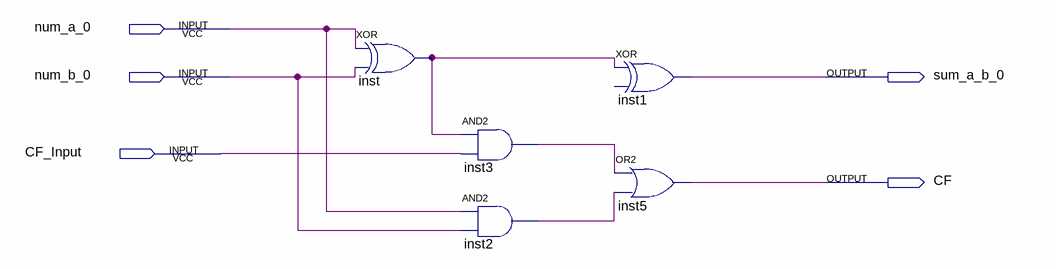
[diagram p0: schematic sheet]
// Quartus schematic alu_scheme.bdf as structural Verilog: 5 symbols, 5 pins
module alu_scheme (
  input  num_a_0,
  input  num_b_0,
  input  CF_Input,
  output sum_a_b_0,
  output CF
);

  wire inst2_out, inst3_out, inst_out;

  xor inst (inst_out, num_a_0, num_b_0);
  and inst3 (inst3_out, inst_out, CF_Input);
  and inst2 (inst2_out, num_a_0, num_b_0);
  buf inst1 (sum_a_b_0, inst_out);  // XOR open: IN2
  or inst5 (CF, inst3_out, inst2_out);
endmodule
